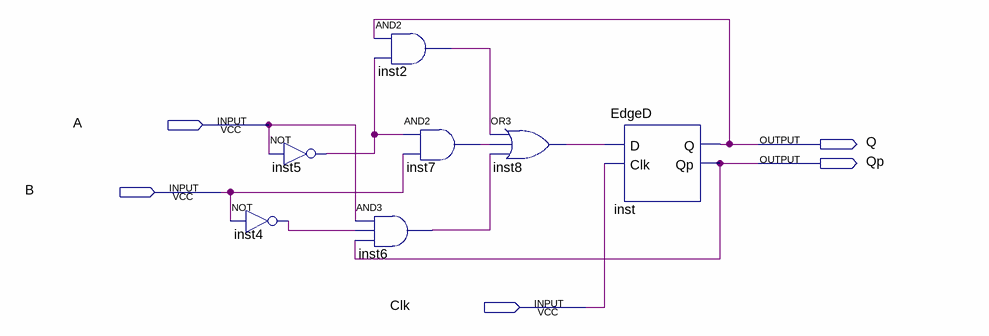
[diagram p0: schematic sheet]
// Quartus schematic AB_ff.bdf as structural Verilog: 7 symbols, 5 pins
module AB_ff (
  input  A,
  input  B,
  input  Clk,
  output Q,
  output Qp
);

  wire inst2_out, inst4_out, inst5_out, inst6_out, inst7_out, inst8_out;

  not inst5 (inst5_out, A);
  not inst4 (inst4_out, B);
  and inst2 (inst2_out, Q, inst5_out);
  and inst6 (inst6_out, A, inst4_out, Qp);
  and inst7 (inst7_out, inst5_out, B);
  or inst8 (inst8_out, inst2_out, inst7_out, inst6_out);
  EdgeD inst (.D(inst8_out), .Clk(Clk), .Q(Q), .Qp(Qp));
endmodule
